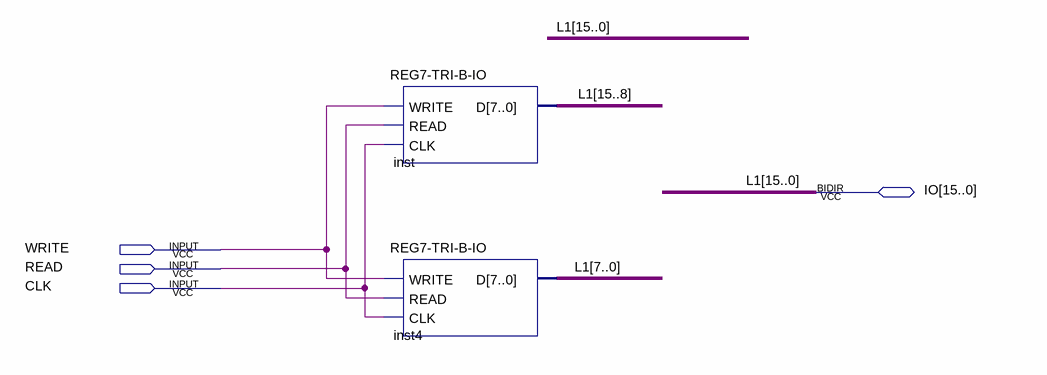
[diagram p0: schematic sheet]
// Quartus schematic REG16-TRI-B-IO.bdf as structural Verilog: 2 symbols, 4 pins
module \REG16-TRI-B-IO  (
  input  WRITE,
  input  READ,
  input  CLK,
  inout  [15:0] IO
);

  \REG7-TRI-B-IO  inst (.WRITE(WRITE), .READ(READ), .CLK(CLK), .D(IO[15:8]));
  \REG7-TRI-B-IO  inst4 (.WRITE(WRITE), .READ(READ), .CLK(CLK), .D(IO[7:0]));

  // Other names for the same wires on the sheet: L1[15:0] = IO
endmodule
